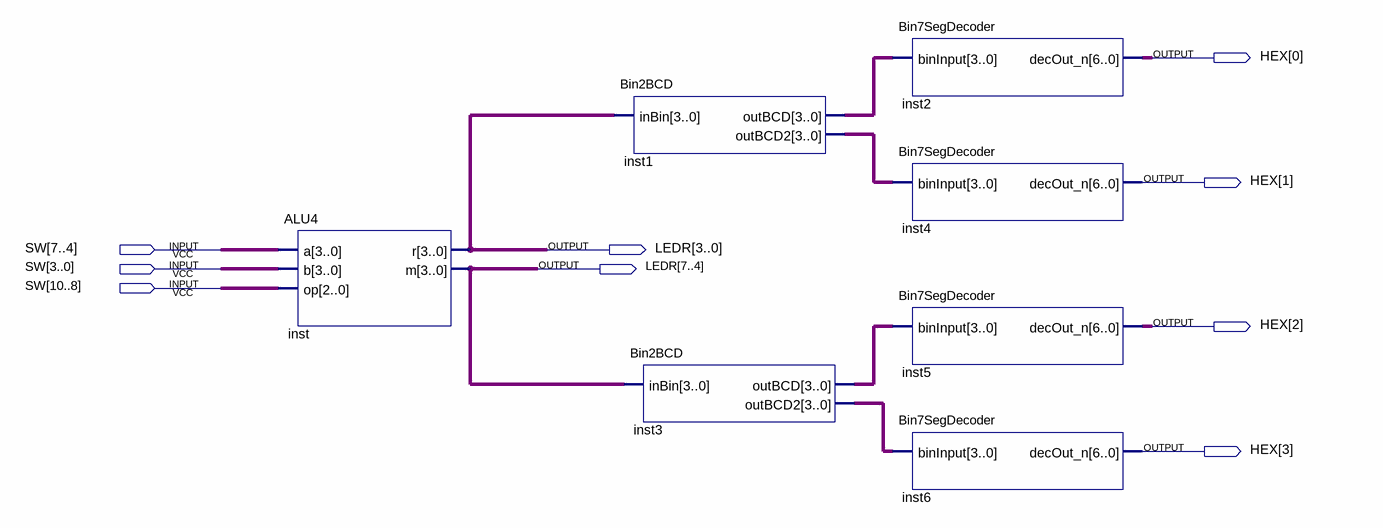
[diagram p0: schematic sheet]
// Quartus schematic ALUDemo.bdf as structural Verilog: 7 symbols, 9 pins
module ALUDemo (
  input  [10:0] SW,
  output [3:0] HEX,
  output [7:0] LEDR
);

  wire [3:0] inst1_outbcd, inst1_outbcd2, inst3_outbcd, inst3_outbcd2;
  wire [6:0] inst2_decout_n, inst5_decout_n;

  ALU4 inst (.a(SW[7:4]), .b(SW[3:0]), .op(SW[10:8]), .r(LEDR[3:0]), .m(LEDR[7:4]));
  Bin2BCD inst1 (.inBin(LEDR[3:0]), .outBCD(inst1_outbcd), .outBCD2(inst1_outbcd2));
  Bin2BCD inst3 (.inBin(LEDR[7:4]), .outBCD(inst3_outbcd), .outBCD2(inst3_outbcd2));
  Bin7SegDecoder inst2 (.binInput(inst1_outbcd), .decOut_n(inst2_decout_n));
  Bin7SegDecoder inst4 (.binInput(inst1_outbcd2), .decOut_n(HEX[1]));
  Bin7SegDecoder inst5 (.binInput(inst3_outbcd), .decOut_n(inst5_decout_n));
  Bin7SegDecoder inst6 (.binInput(inst3_outbcd2), .decOut_n(HEX[3]));
endmodule
